# Altium project 499H_VOL_DEV_V1.PrjPcb (part 1 of 2)
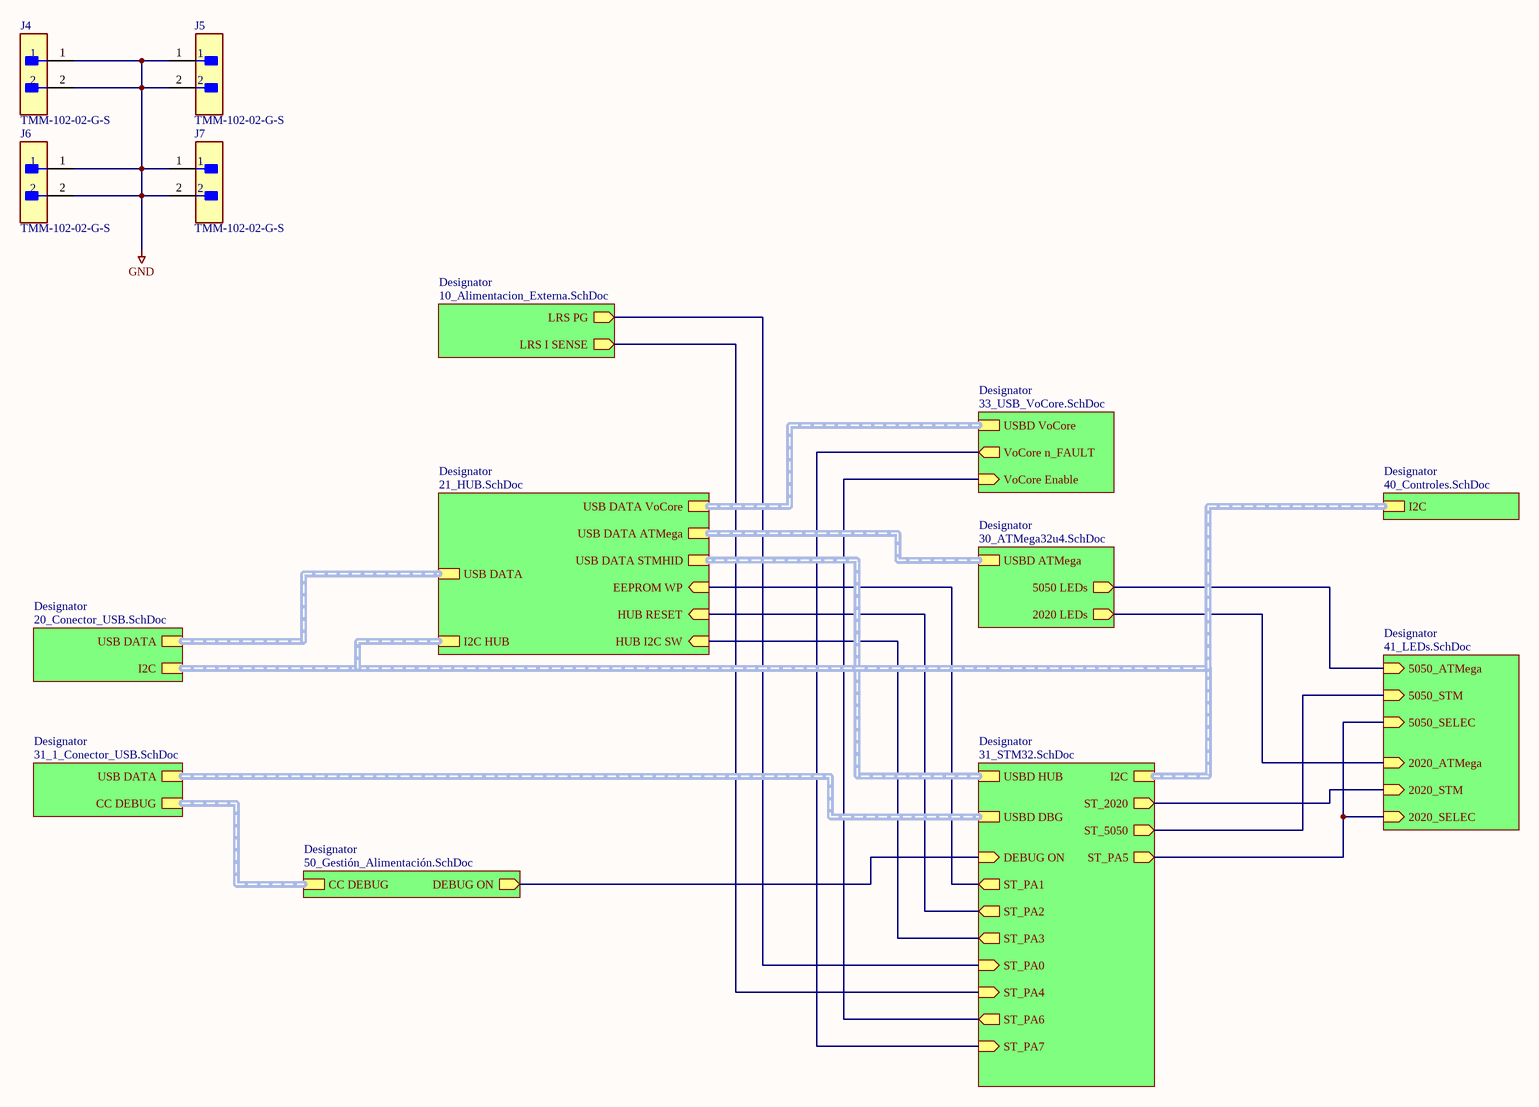
[diagram p0: 00_Principal.SchDoc]
11 sheets, 247 parts. Net scope: hierarchical (ports join the sheet entries above them; power ports are global).
Board file: Placa PCB.PcbDoc
Sheets:
  00_Principal.SchDoc
    Designator = 10_Alimentacion_Externa.SchDoc
    Designator = 20_Conector_USB.SchDoc
    Designator = 21_HUB.SchDoc
    Designator = 31_1_Conector_USB.SchDoc
    Designator = 50_Gestión_Alimentación.SchDoc
    Designator = 31_STM32.SchDoc
    Designator = 30_ATMega32u4.SchDoc
    Designator = 33_USB_VoCore.SchDoc
    Designator = 41_LEDs.SchDoc
    Designator = 40_Controles.SchDoc

## Sheet 00_Principal.SchDoc
size A3; SheetNumber: 1; SheetTotal: 11

### Parts
J4  TMM-102-02-G-S  [FP-TMM-102-02-G-S-MFG]
J5  TMM-102-02-G-S  [FP-TMM-102-02-G-S-MFG]
J6  TMM-102-02-G-S  [FP-TMM-102-02-G-S-MFG]
J7  TMM-102-02-G-S  [FP-TMM-102-02-G-S-MFG]

### Sub-sheets
Designator = 10_Alimentacion_Externa.SchDoc: LRS PG (out), LRS I SENSE (out)
Designator = 20_Conector_USB.SchDoc: USB DATA (harness USBD LINK), I2C (harness I2C BUS)
Designator = 21_HUB.SchDoc: HUB RESET (in), USB DATA (harness USBD BUS), USB DATA VoCore (harness USBD BUS), USB DATA ATMega (harness USBD BUS), USB DATA STMHID (harness USBD BUS), EEPROM WP (in), HUB I2C SW (in), I2C HUB (harness I2C BUS)
Designator = 31_1_Conector_USB.SchDoc: USB DATA (harness USBD LINK), CC DEBUG (harness CC BUS)
Designator = 50_Gestión_Alimentación.SchDoc: CC DEBUG (harness CC BUS), DEBUG ON (out)
Designator = 31_STM32.SchDoc: USBD HUB (harness USBD BUS), I2C (harness I2C BUS), ST_2020 (out), ST_5050 (out), ST_PA0 (in), ST_PA1 (out), ST_PA2 (out), ST_PA3 (out), ST_PA4 (in), ST_PA5 (out), DEBUG ON (in), USBD DBG (harness USBD BUS), ST_PA7 (in), ST_PA6 (out)
Designator = 30_ATMega32u4.SchDoc: 5050 LEDs (out), 2020 LEDs (out), USBD ATMega (harness USBD BUS)
Designator = 33_USB_VoCore.SchDoc: USBD VoCore (harness USBD BUS), VoCore n_FAULT (out), VoCore Enable (in)
Designator = 41_LEDs.SchDoc: 5050_ATMega (in), 5050_STM (in), 5050_SELEC (in), 2020_ATMega (in), 2020_STM (in), 2020_SELEC (in)
Designator = 40_Controles.SchDoc: I2C (harness I2C BUS)

### Nets
GND: J4.1 J4.2 J5.1 J5.2 J6.1 J6.2 J7.1 J7.2
AT_2020: sheet Designator/2020 LEDs, sheet Designator/2020_ATMega
AT_5050: sheet Designator/5050 LEDs, sheet Designator/5050_ATMega
DEBUG ON: sheet Designator/DEBUG ON, sheet Designator/DEBUG ON
HUB_RESET: sheet Designator/HUB RESET, sheet Designator/ST_PA2
IMON: sheet Designator/LRS I SENSE, sheet Designator/ST_PA4
LRS PG: sheet Designator/LRS PG, sheet Designator/ST_PA0
ST_2020: sheet Designator/ST_2020, sheet Designator/2020_STM
ST_5050: sheet Designator/ST_5050, sheet Designator/5050_STM
ST_PA1: sheet Designator/EEPROM WP, sheet Designator/ST_PA1
ST_PA3: sheet Designator/HUB I2C SW, sheet Designator/ST_PA3
ST_PA5: sheet Designator/ST_PA5, sheet Designator/5050_SELEC, sheet Designator/2020_SELEC
ST_PA6: sheet Designator/ST_PA6, sheet Designator/VoCore Enable
ST_PA7: sheet Designator/ST_PA7, sheet Designator/VoCore n_FAULT

### Buses and harness runs
harness sheet Designator/I2C = sheet Designator/I2C HUB
harness sheet Designator/USB DATA = sheet Designator/USBD DBG
harness sheet Designator/USB DATA ATMega = sheet Designator/USBD ATMega
harness sheet Designator/USB DATA STMHID = sheet Designator/USBD HUB
harness sheet Designator/USB DATA VoCore = sheet Designator/USBD VoCore

### Library data of the parts
J4-J7 = CMP-02766-001563-1: CONN HEADER VERT 2POS 2MM; Gender: Male; Number of Positions: 2; Max Current Rating: 3.9A; Max Voltage Rating (AC): 500V; Fastening Type: Pull; Series: TMM; Orientation: Straight; RoHS Compliant: Yes; Contact Shape: Square; Packaging: Bulk; Max Operating Temperature: 125°C; Pitch: 2mm; Termination: Solder; Insulation Color: Black; Contact Plating: Gold; Radiation Hardening: No; Contact Finish - Mating: GOLD; Insulation Material: Polymer; Number of Contacts: 2; Depth: 1.97mm; Contact Type: Male Pin; Number of Rows: 1; Connector Type: Header; Mount: Through Hole; Min Operating Temperature: -55°C; Housing Material: Polymer; Contact Material: Bronze; Housing Color: Black; Length: 4mm

## Sheet 10_Alimentacion_Externa.SchDoc
size A4; SheetNumber: 2; SheetTotal: 11
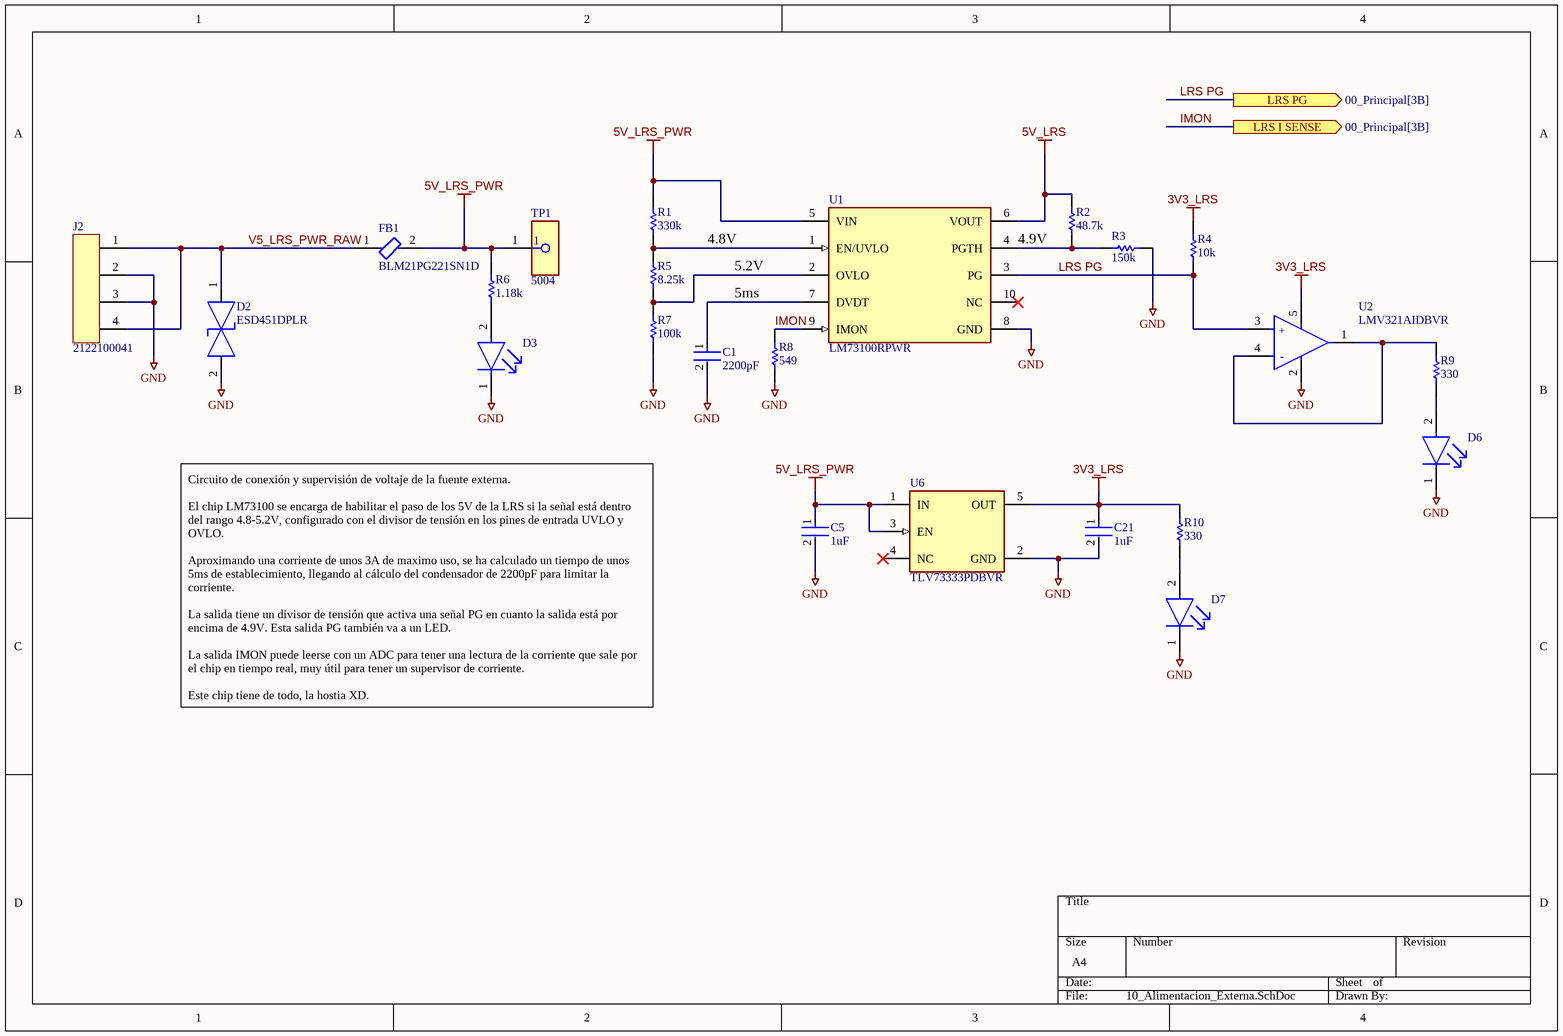
[diagram p1: 10_Alimentacion_Externa.SchDoc]

### Parts
C1  2200pF  [FP-AC0402-0_5-MFG]
C5  1uF  [FP-C0402C-BB-IPC_B]
C21  1uF  [FP-C0402C-BB-IPC_B]
D2  ESD451DPLR  [FP-DPL0002A_MFG]
D3  APHD1608LZGCK  [FP-APHD1608LZGCK-MFG]  (value not drawn)
D6  APHD1608LZGCK  [FP-APHD1608LZGCK-MFG]  (value not drawn)
D7  APHD1608LZGCK  [FP-APHD1608LZGCK-MFG]  (value not drawn)
FB1  BLM21PG221SN1D  [FP-BLM21-0_2-t0_85-e0_5-IPC_B]
J2  2122100041  [2122100041]
R1  330k  [RESC1005X40X25ML05T05]
R2  48.7k  [RESC1005X40X25ML05T05]
R3  150k  [RESC1005X40X25NL05T05]
R4  10k  [RESC1005X40X25ML05T05]
R5  8.25k  [RESC1005X40X25LL05T05]
R6  1.18k  [RESC1005X40X25NL05T05]
R7  100k  [RESC1005X40X25LL05T05]
R8  549  [RESC1005X40X25LL05T05]
R9  330  [RESC1005X40X25NL10T10]
R10  330  [RESC1005X40X25NL10T10]
TP1  5004  [FP-5004-MFG]
U1  LM73100RPWR  [FP-RPW0010A-MFG]
U2  LMV321AIDBVR  [FP-DBV0005A-MFG]
U6  TLV73333PDBVR  [FP-DBV0005A-MFG]

### Ports
LRS I SENSE (out, see 00_Principal[3B]), LRS PG (out, see 00_Principal[3B])

### Nets
3V3_LRS: C21.1 R4.2 R10.2 U2.5(V+) U6.5(OUT)
5V_LRS: R2.2 U1.6(VOUT)
5V_LRS_PWR: C5.1 FB1.2 R1.2 R6.2 TP1.1 U1.5(VIN) U6.1(IN) U6.3(EN)
GND: C1.2 C5.2 C21.2 D2.2(2_IO) D3.1(C) D6.1(C) D7.1(C) J2.2 J2.3 R3.2 R7.2 R8.1 U1.8(GND) U2.2(V-) U6.2(GND)
IMON: R8.2 U1.9(IMON) ; port LRS I SENSE
LRS PG: R4.1 U1.3(PG) U2.3(+IN) ; port LRS PG
V5_LRS_PWR_RAW: D2.1(1_IO) FB1.1 J2.1 J2.4
NetC1_1: C1.1 U1.7(DVDT)
NetD3_2: D3.2(A) R6.1
NetD6_2: D6.2(A) R9.1
NetD7_2: D7.2(A) R10.1
NetR1_1: R1.1 R5.2 U1.1(EN/UVLO)
NetR2_1: R2.1 R3.1 U1.4(PGTH)
NetR5_1: R5.1 R7.1 U1.2(OVLO)
NetR9_2: R9.2 U2.1(OUT) U2.4(-IN)

Not connected (* = marked no-connect by the designer): U1 10(NC)*; U6 4(NC)*

### Notes on the sheet
- 4.8V
- 4.9V
- 5.2V
- 5ms
- Circuito de conexión y supervisión de voltaje de la fuente externa.
  El chip LM73100 se encarga de habilitar el paso de los 5V de la LRS si la señal está dentro del rango 4.8-5.2V, configurado con el divisor de tensión en los pines de entrada UVLO y OVLO.
  Aproximando una corriente de unos 3A de maximo uso, se ha calculado un tiempo de unos 5ms de establecimiento, llegando al cálculo del condensador de 2200pF para limitar la corriente.
  La salida tiene un divisor de tensión que activa una señal PG en cuanto la salida está por encima de 4.9V. Esta salida PG también va a un LED.
  La salida IMON puede leerse con un ADC para tener una lectura de la corriente que sale por el chip en tiempo real, muy útil para tener un supervisor de corriente.
  Este chip tiene de todo, la hostia XD.
- (in symbol CMP-04895-000333-1) +; -

### Library data of the parts
C1 = CMP-03422-000165-1: CAP CER 2200PF 16V X7R 0402; Manufacturer Part Number: AC0402KRX7R7BB222; Manufacturer: Yageo; Capacitance: 2.2 nF; Temperature Coefficient: ±15%; Automotive Grade: Grade 1; Value: 2.2 nF; Material: Ceramic; Tolerance: 0.1; Digikey Description: CAP CER 2200PF 16V X7R 0402; Temperature: -55°C to +125°C; Device Class L1: Passive Components; Device Class L3: Ceramic Capacitors; Temperature Range High: +125°C; Temperature Characteristic: X7R; Lead Free: Yes; Device Class L2: Capacitors; Voltage Rating: 16 V; Package: AC0402-0.5; Temperature Range Low: -55°C; Footprint Url: http://www.yageo.com/exep/pages/download/literatures/UPY-C_GEN_24.pdf; ComponentLink2Description: Datasheet; Automotive: Yes; Mouser Description: Cap Ceramic 0.0022uF 16V X7R 10% SMD 0402 125°C Paper T/R; Octopart: https://octopart.com/ac0402krx7r7bb222-yageo-76900921; Height: 0.55mm; ComponentLink2URL: http://www.yageo.com/documents/recent/UPY-AC_NP0X7R_16V-to-630V_12.pdf; Category: Cap; RoHS: TRUE; Ipc Land Pattern Name: CAPC10050X50
C5 C21 = CMP-03020-034679-1: CAP CER 1UF 16V X5R 0402; Dielectric Material: Ceramic; Tolerance: 10%; RoHS Compliant: Yes; Voltage Rating (DC): 16V; Voltage Rating: 16V; Max Operating Temperature: 85°C; Packaging: Cut Tape; Width: 0.02inch; Dielectric: X5R; Lead Free: Lead Free; Min Operating Temperature: -55°C; Mount: Surface Mount; Case/Package: 0402; Thickness: 0.022inch; REACH SVHC: No SVHC; Length: 0.039inch; Case Code (Metric): 1005; Case Code (Imperial): 0402; Capacitance: 1uF
D2 = CMP-00370-140306676-1: 0.5-pF, 5.5-V, 30-KV bidirectional ESD protection device in 0201 package 2-X2SON -40 to 125; Manufacturer Lifecycle Status: ACTIVE; Thickness: 300µm; ComponentLink3URL: https://www.ti.com/lit/ds/symlink/tpd1e04u04.pdf?ts=1701165483995&ref_url=https%253A%252F%252Fwww.ti.com%252Fproduct%252FTPD1E04U04%252Fpart-details%252FTPD1E04U04DPLR; ComponentLink3Description: Manufacturer's Package Drawing; Lifecycle Status: Production; ComponentLink1URL: http://ti.com; ComponentLink2Description: HelpURL; Width: 300µm; ComponentLink2URL: https://www.ti.com/lit/ds/symlink/esd451.pdf; Height: 320µm; Number of Pins: 2; ComponentLink1Description: Manufacturer's Website; Length: 600µm
D3 D6 D7 = CMP-44529-000045-1: LED GREEN CLEAR 1608 SMD; Test Current: 2mA; Dominant Wavelength: 525nm; Lens Color: Colorless; Luminous Intensity: 180mcd; Viewing Angle: 100°; Forward Voltage: 2.65V; Lens Size: 0.7mm; Lens Style: Round; Mount: Surface Mount; Packaging: Tape and Reel; Lens Transparency: Clear; Height: 0.75mm; Case/Package: 0603; Length: 1.6mm; Case Code (Metric): 1608; Width: 0.8mm; Color: Green; Case Code (Imperial): 0603
FB1 = CMP-0686-00610-3: Chip Ferrite Bead, 0805, 220Ω @ 100MHz, 0.045Ω, 25%, 2A; Number of Circuits: 1; Shielding: Unshielded; DC Resistance (DCR): 45mR; Impedance: 220R; Radiation Hardening: No; Material: Ferrite; Frequency: 100MHz; Width: 1.25mm; DC Current: 2A; Max DC Current: 2A; Number of Lines: 1; Package Quantity: 1; Case Code (Metric): 2012; Current Rating: 2A; Case/Package: 0805; Current: 2A; Military Standard: Not; Core Material: Ferrite; Depth: 1.25mm; Contact Plating: Tin; DC Resistance-Max: 45mR; Max Operating Temperature: 125°C; Length: 2mm; Max Current Rating: 2A; REACH SVHC: No SVHC; Termination: SMD/SMT; Min Operating Temperature: -55°C; Series: BLM21P; Test Frequency: 100MHz; Tolerance: 25%; Number of Pins: 2; RoHS Compliant: Yes; Height: 0.85mm; Packaging: Tape and Reel; Lead Free: Lead Free; Case Code (Imperial): 0805
R1 = CMP-1011-00134-2: Part Number: ERJ-2GEJ334X; Manufacturer: Panasonic
R2 = CMP-2002-00962-1: Part Number: ERJ-2RKF4872X; Manufacturer: Panasonic
R3 = CMP-2002-00459-1: Part Number: ERJ-2GEJ154X; Manufacturer: Panasonic
R4 = CMP-2002-00601-1: Manufacturer: Panasonic; Part Number: ERJ-2RHD1002X
R5 = CMP-2002-01079-1: Part Number: ERJ-2RKF8251X; Manufacturer: Panasonic
R6 = CMP-1011-00517-2: Part Number: ERJ-2RKF1181X; Manufacturer: Panasonic
R7 = CMP-2002-00602-1: Manufacturer: Panasonic; Part Number: ERJ-2RHD1003X
R8 = CMP-2002-00989-1: Manufacturer: Panasonic; Part Number: ERJ-2RKF5490X
R9 R10 = CMP-2002-05883-1: Manufacturer: Panasonic; Part Number: ERA2AEB331X
TP1 = CMP-2000-05575-2: PC TEST POINT MINIATURE YELLOW; Manufacturer: Keystone; Number Of Contacts: 1; Is Female: yes; Device Class L1: Connectors; Manufacturer Part Number: 5004; Digikey Description: PC TEST POINT MINIATURE YELLOW; ComponentLink2URL: https://www.keyelco.com/product-pdf.cfm?p=1313; Lead Free: Yes; ComponentLink2Description: Datasheet; Category: Conn; Height: 4.72mm; Octopart: https://octopart.com/5004-keystone-28591; Mouser Description: TEST POINT PC MINI .040"D YELLOW; Device Class L3: unset; Contact Material: Silver; Package: 5004; Automotive: No; Device Class L2: unset; RoHS: TRUE
U1 = CMP-04910-000122-1: 2.7-V TO 23-V, 5.5-A IDEAL DIODE; RoHS Compliant: Yes
U2 = CMP-04895-000333-1: IC OPAMP GP 1 CIRCUIT SOT23-5; Input Bias Current: 10pA; Output Current per Channel: 40mA; Gain Bandwidth Product: 1MHz; Input Offset Voltage (Vos): 1mV; Number of Channels: 1; Operating Supply Current: 80uA; Slew Rate: 1.7V/µs; Mount: Surface Mount; Min Operating Temperature: -40°C; Packaging: Cut Tape; Case/Package: SOT-23-5; RoHS Compliant: Yes; Max Operating Temperature: 125°C; Number of Circuits: 1
U6 = CMP-04917-000053-1: IC REG LINEAR 3.3V 300MA SOT23-5; Manufacturer: Texas Instruments; Max Junction Temp: +125°C; Accuracy Percentage: 1%; Min Supply Voltage: 1.4V; Number Of Outputs: 1; Dropout Voltage: 125mV; Nominal Supply Current: 34uA; Max Supply Voltage: 5.5V; Output Type: Fixed; Standoff Height: 0mm; Digikey Description: IC REG LINEAR 3.3V 300MA SOT23-5; Manufacturer Part Number: TLV73333PDBVR; Temperature Range High: +125°C; Temperature: -40°C to +125°C; Output Current: 300mA; Mouser Description: LDO Voltage Regulators Capacitr-Free 300-mA 5-SOT-23 -40 to 125; Automotive: No; Height: 1.45mm; Device Class L3: Voltage Regulators - Linear; ComponentLink2Description: Datasheet; Device Class L1: Integrated Circuits (ICs); ComponentLink2URL: http://www.ti.com/lit/ds/symlink/tlv733p.pdf; Octopart: https://octopart.com/tlv73333pdbvr-texas+instruments-51080890; Temperature Range Low: -40°C; RoHS: TRUE; Lead Free: Yes; Output Voltage: 3.3V; Package: DBV0005A; Device Class L2: Power Management ICs; Category: IC

## Sheet 20_Conector_USB.SchDoc
size A4; SheetNumber: 3; SheetTotal: 11
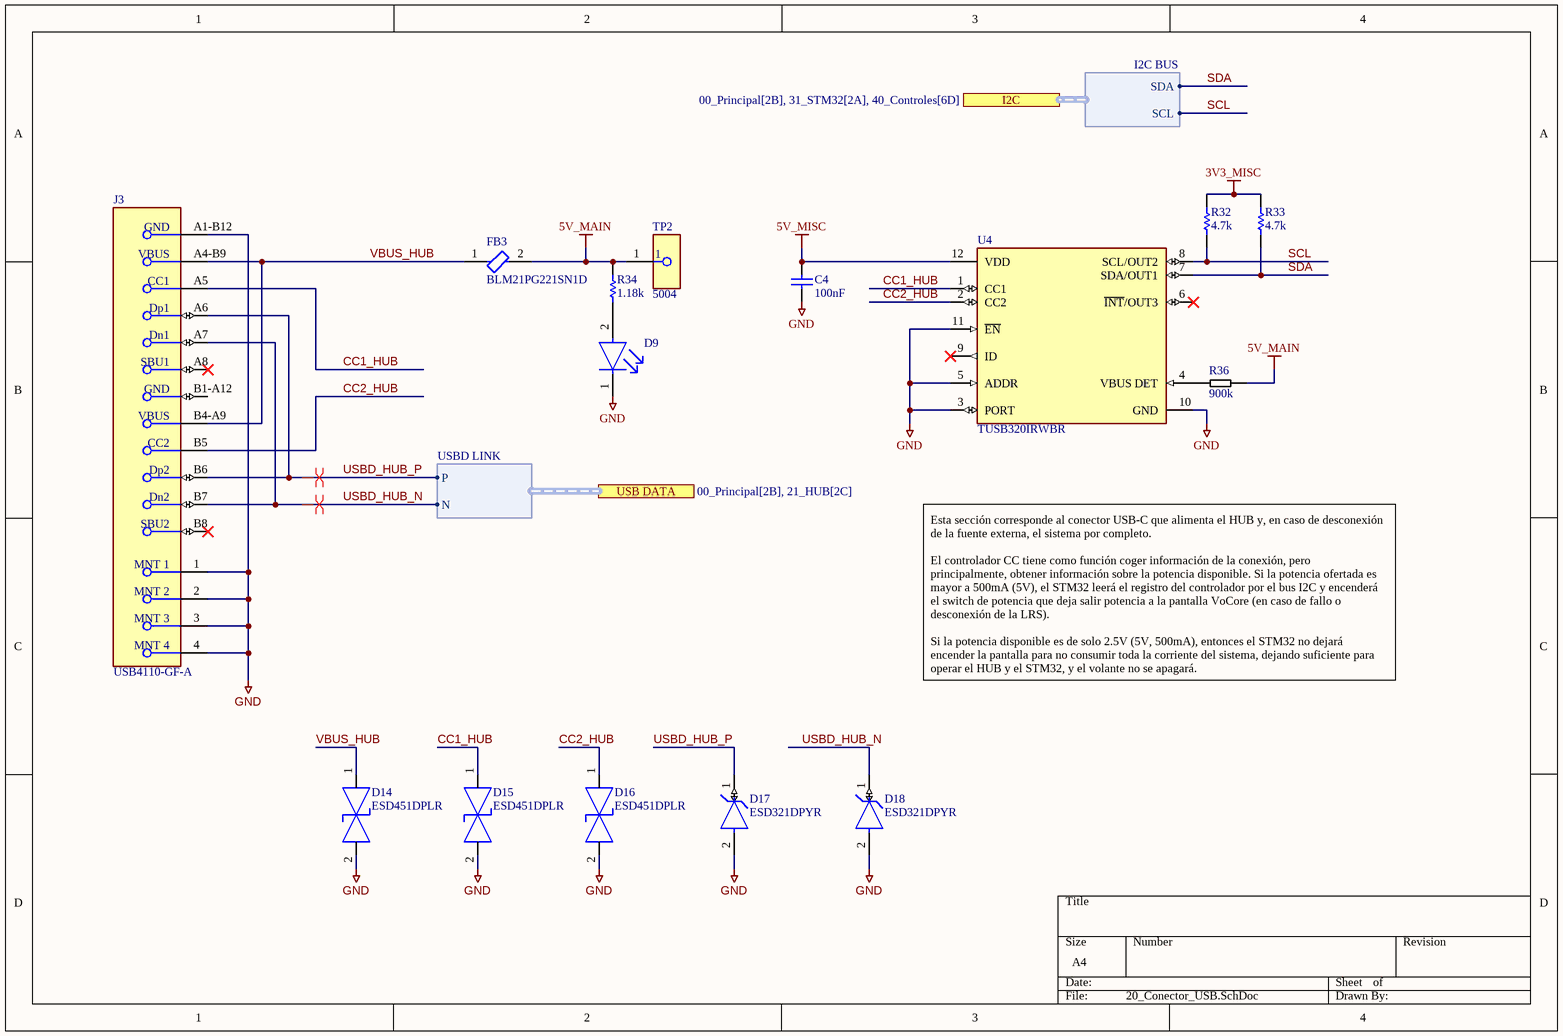
[diagram p2: 20_Conector_USB.SchDoc]

### Parts
C4  100nF  [CAPC1005X55X25NL05T05]
D9  APHD1608LZGCK  [FP-APHD1608LZGCK-MFG]  (value not drawn)
D14  ESD451DPLR  [FP-DPL0002A_MFG]
D15  ESD451DPLR  [FP-DPL0002A_MFG]
D16  ESD451DPLR  [FP-DPL0002A_MFG]
D17  ESD321DPYR  [FP-DPY0002A-MFG]
D18  ESD321DPYR  [FP-DPY0002A-MFG]
FB3  BLM21PG221SN1D  [FP-BLM21-0_2-t0_85-e0_5-IPC_B]
J3  USB4110-GF-A  [FP-USB4110-GF-A-MFG]
R32  4.7k  [RESC1005X40X25ML05T10]
R33  4.7k  [RESC1005X40X25ML05T10]
R34  1.18k  [RESC1005X40X25NL05T05]
R36  900k  [RES 1206]
TP2  5004  [FP-5004-MFG]
U4  TUSB320IRWBR  [FP-RWB0012A-MFG]

### Ports
I2C (harness I2C BUS, see 00_Principal[2B], 31_STM32[2A], 40_Controles[6D]), USB DATA (harness USBD LINK, see 00_Principal[2B], 21_HUB[2C])

### Harnesses
USBD LINK: P, N
I2C BUS: SDA, SCL

### Nets
3V3_MISC: R32.2 R33.2
5V_MAIN: FB3.2 R34.2 R36.1 TP2.1
5V_MISC: C4.2 U4.12(VDD)
GND: C4.1 D9.1(C) D14.2(2_IO) D15.2(2_IO) D16.2(2_IO) D17.2(GND) D18.2(GND) J3.1(MNT_1) J3.2(MNT_2) J3.3(MNT_3) J3.4(MNT_4) J3.A1-B12(GND) U4.3(PORT) U4.5(ADDR) U4.10(GND) U4.11(~{EN})
CC1_HUB: D15.1(1_IO) J3.A5(CC1) U4.1(CC1)
CC2_HUB: D16.1(1_IO) J3.B5(CC2) U4.2(CC2)
SCL: R32.1 U4.8(SCL/OUT2) ; port I2C.SCL
SDA: R33.1 U4.7(SDA/OUT1) ; port I2C.SDA
USBD_HUB_N: D18.1(IO) J3.A7(Dn1) J3.B7(Dn2) ; port USB DATA.N
USBD_HUB_P: D17.1(IO) J3.A6(Dp1) J3.B6(Dp2) ; port USB DATA.P
VBUS_HUB: D14.1(1_IO) FB3.1 J3.A4-B9(VBUS) J3.B4-A9(VBUS)
NetD9_2: D9.2(A) R34.1
NetR36_2: R36.2 U4.4(VBUS_DET)

Not connected (* = marked no-connect by the designer): J3 A8(SBU1)* B1-A12(GND) B8(SBU2)*; U4 6(~{INT}/OUT3)* 9(ID)*

### Layout directives
differential pair; rule Differential Pairs Routing [Pref Gap = 5mil    Min Gap  = 5mil    Max Gap  = 5milPref Width = 8.655mil    Min Width  = 8.655mil    Max Width  = 8.655mil]: USBD_HUB_N, USBD_HUB_P

### Notes on the sheet
- Esta sección corresponde al conector USB-C que alimenta el HUB y, en caso de desconexión de la fuente externa, el sistema por completo.
  El controlador CC tiene como función coger información de la conexión, pero principalmente, obtener información sobre la potencia disponible. Si la potencia ofertada es mayor a 500mA (5V), el STM32 leerá el registro del controlador por el bus I2C y encenderá el switch de potencia que deja salir potencia a la pantalla VoCore (en caso de fallo o desconexión de la LRS).
  Si la potencia disponible es de solo 2.5V (5V, 500mA), entonces el STM32 no dejará encender la pantalla para no consumir toda la corriente del sistema, dejando suficiente para operar el HUB y el STM32, y el volante no se apagará.

### Library data of the parts
C4 = CMP-2008-02030-1: Manufacturer: Vitramon; Part Number: VJ0402Y104KXJCW1BC
D9 = CMP-44529-000045-1: as D3 on sheet 10_Alimentacion_Externa; Mount: Surface Mount; Packaging: Tape and Reel; Lens Transparency: Clear; Height: 0.75mm; Case/Package: 0603; Length: 1.6mm; Case Code (Metric): 1608; Width: 0.8mm; Color: Green; Case Code (Imperial): 0603
D14-D16 = CMP-00370-140306676-1: as D2 on sheet 10_Alimentacion_Externa; Thickness: 300µm; ComponentLink3URL: https://www.ti.com/lit/ds/symlink/tpd1e04u04.pdf?ts=1701165483995&ref_url=https%253A%252F%252Fwww.ti.com%252Fproduct%252FTPD1E04U04%252Fpart-details%252FTPD1E04U04DPLR; ComponentLink3Description: Manufacturer's Package Drawing; Lifecycle Status: Production; ComponentLink1URL: http://ti.com; ComponentLink2Description: HelpURL; Width: 300µm; ComponentLink2URL: https://www.ti.com/lit/ds/symlink/esd451.pdf; Height: 320µm; Number of Pins: 2; ComponentLink1Description: Manufacturer's Website; Length: 600µm
D17 D18 = CMP-04989-000001-1: HDMI2.0 ESD PROTECTION; Manufacturer: Texas Instruments; Standoff Height: 0mm; Peak Pulse Current: 6A; Value: 0.9pF; Number Of Channels: 1; Reverse Standoff Voltage: 3.6V; Peak Pulse Power: 40W; Breakdown Voltage: 4.5V; Direction: Unidirectional; Clamping Voltage: 6.8V; RoHS: TRUE; Temperature: -40°C to +125°C; Package: DPY0002A; Temperature Range Low: -40°C; Temperature Range High: +125°C; Category: Diode; Capacitance: 0.9pF; Ambient Temperature Range Low: -40°C; Device Class L3: unset; Device Class L1: Circuit Protection; Ambient Temperature Range High: +125°C; ComponentLink2URL: http://www.ti.com/lit/ds/symlink/esd321.pdf; Octopart: https://octopart.com/esd321dpyr-texas+instruments-94354200; Manufacturer Part Number: ESD321DPYR; Digikey Description: HDMI2.0 ESD PROTECTION; Lead Free: Yes; ComponentLink2Description: Datasheet; Device Class L2: TVS Diodes; Height: 0.45mm; Automotive: No
FB3 = CMP-0686-00610-3: as FB1 on sheet 10_Alimentacion_Externa; Radiation Hardening: No; Material: Ferrite; Frequency: 100MHz; Width: 1.25mm; DC Current: 2A; Max DC Current: 2A; Number of Lines: 1; Package Quantity: 1; Case Code (Metric): 2012; Current Rating: 2A; Case/Package: 0805; Current: 2A; Military Standard: Not; Core Material: Ferrite; Depth: 1.25mm; Contact Plating: Tin; DC Resistance-Max: 45mR; Max Operating Temperature: 125°C; Length: 2mm; Max Current Rating: 2A; REACH SVHC: No SVHC; Termination: SMD/SMT; Min Operating Temperature: -55°C; Series: BLM21P; Test Frequency: 100MHz; Tolerance: 25%; Number of Pins: 2; RoHS Compliant: Yes; Height: 0.85mm; Packaging: Tape and Reel; Lead Free: Lead Free; Case Code (Imperial): 0805
J3 = CMP-245163-000002-1: CONN USB 2.0 TYPE-C R/A SMT; Manufacturer: GCT; Conn Orientation: Right Angle; Usb Standard: USB 2.0; Voltage Rating: 20V; Current Rating: 3/4.25/1.25/0.25A; Number Of Contacts: 16; Is Female: yes; Shielding: true; Standoff Height: 0.1mm; Octopart: https://octopart.com/usb4110-gf-a-gct-103941985; Temperature: -40°C to +85°C; RoHS: TRUE; Automotive: No; Contact Material: Gold,Nickel; Device Class L1: Connectors; Device Class L2: USB Connectors; Package: 0; Lead Free: Yes; ComponentLink2URL: https://gct.co/files/drawings/usb4110.pdf; Temperature Range High: +85°C; Temperature Range Low: -40°C; Height: 3.46mm; Manufacturer Part Number: USB4110-GF-A; ComponentLink2Description: Datasheet; Device Class L3: unset; Digikey Description: CONN USB 2.0 TYPE-C R/A SMT; Category: Conn
R32 R33 = CMP-2002-06456-1: Manufacturer: Panasonic; Part Number: ERJ-S02F4701X
R34 = CMP-1011-00517-2: as R6 on sheet 10_Alimentacion_Externa
R36 = RT1206CRE07900KL: 900k Resistor 200V 1206 0.5%; Supplier 1: DigiKey; Supplier Part Number 1: 13-RT1206CRE07900KLCT-ND
TP2 = CMP-2000-05575-2: as TP1 on sheet 10_Alimentacion_Externa; Device Class L1: Connectors; Manufacturer Part Number: 5004; Digikey Description: PC TEST POINT MINIATURE YELLOW; ComponentLink2URL: https://www.keyelco.com/product-pdf.cfm?p=1313; Lead Free: Yes; ComponentLink2Description: Datasheet; Category: Conn; Height: 4.72mm; Octopart: https://octopart.com/5004-keystone-28591; Mouser Description: TEST POINT PC MINI .040"D YELLOW; Device Class L3: unset; Contact Material: Silver; Package: 5004; Automotive: No; Device Class L2: unset; RoHS: TRUE
U4 = CMP-04877-000006-1: IC INTERFACE SPECIALIZED 12X2QFN; Number of Ports: 1; Max Supply Voltage: 5V; USB Standard: USB 1.1; Interface: I2C; Min Supply Voltage: 2.7V; ESD Protection: Yes; Data Rate: 480Mbps; REACH SVHC: No SVHC; Mount: Surface Mount; Min Operating Temperature: -40°C; Case/Package: TQFP; Lead Free: Lead Free; Length: 1.65mm; Contact Plating: Gold; Height: 0.4mm; Max Operating Temperature: 85°C; Number of Pins: 12; Packaging: Tape and Reel; RoHS Compliant: Yes; Width: 1.65mm

## Sheet 21_HUB.SchDoc
size A3; SheetNumber: 5; SheetTotal: 11
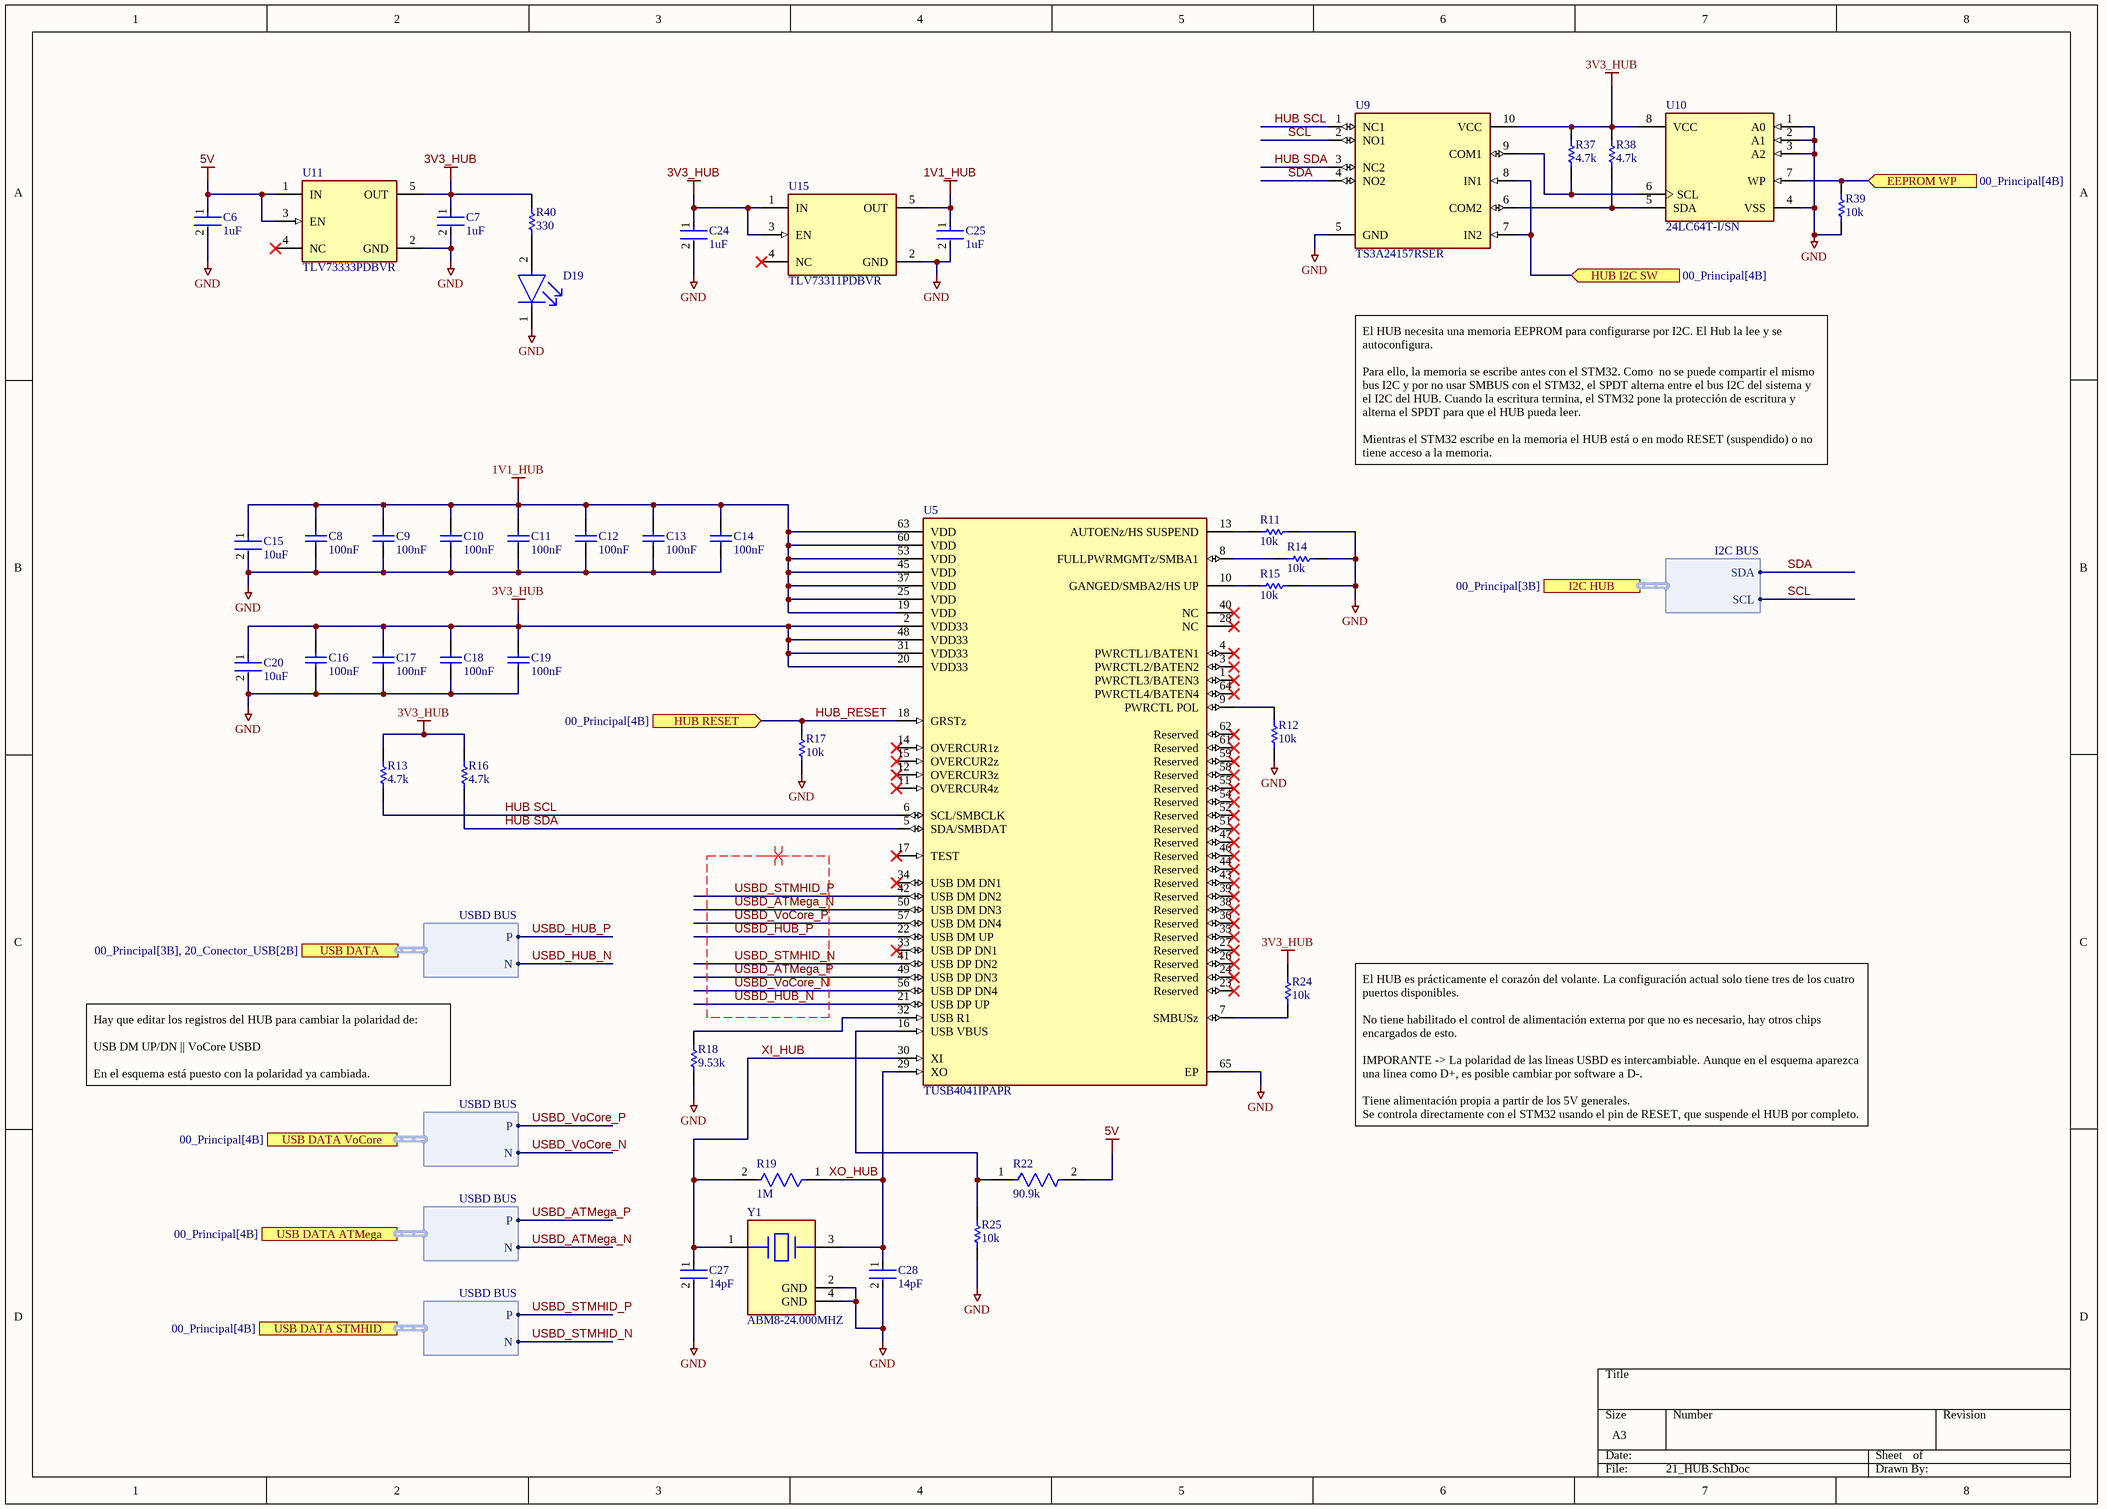
[diagram p3: 21_HUB.SchDoc]

### Parts
C6  1uF  [FP-C0402C-BB-IPC_B]
C7  1uF  [FP-C0402C-BB-IPC_B]
C8  100nF  [CAPC1005X55X25NL05T05]
C9  100nF  [CAPC1005X55X25NL05T05]
C10  100nF  [CAPC1005X55X25NL05T05]
C11  100nF  [CAPC1005X55X25NL05T05]
C12  100nF  [CAPC1005X55X25NL05T05]
C13  100nF  [CAPC1005X55X25NL05T05]
C14  100nF  [CAPC1005X55X25NL05T05]
C15  10uF  [FP-GRM155-0_2-MFG]
C16  100nF  [CAPC1005X55X25NL05T05]
C17  100nF  [CAPC1005X55X25NL05T05]
C18  100nF  [CAPC1005X55X25NL05T05]
C19  100nF  [CAPC1005X55X25NL05T05]
C20  10uF  [FP-GRM155-0_2-MFG]
C24  1uF  [FP-C0402C-BB-IPC_B]
C25  1uF  [FP-C0402C-BB-IPC_B]
C27  14pF  [FP-GJM155-0_05-IPC_C]
C28  14pF  [FP-GJM155-0_05-IPC_C]
D19  APHD1608LZGCK  [FP-APHD1608LZGCK-MFG]  (value not drawn)
R11  10k  [RESC1005X40X25ML05T05]
R12  10k  [RESC1005X40X25NL05T05]
R13  4.7k  [RESC1005X40X25ML05T10]
R14  10k  [RESC1005X40X25ML05T05]
R15  10k  [RESC1005X40X25ML05T05]
R16  4.7k  [RESC1005X40X25ML05T10]
R17  10k  [RESC1005X40X25ML05T05]
R18  9.53k  [RESC1609X50X30NL10T20]
R19  1M  [FP-CRCW0402-C-e3-IPC_B]
R22  90.9k  [FP-RK73H1E-IPC_C]
R24  10k  [RESC1005X40X25NL05T05]
R25  10k  [RESC1005X40X25NL05T05]
R37  4.7k  [RESC1005X40X25ML05T10]
R38  4.7k  [RESC1005X40X25ML05T10]
R39  10k  [RESC1005X40X25ML05T05]
R40  330  [RESC1005X40X25NL10T10]
U5  TUSB4041IPAPR  [FP-PAP0064K-MFG]
U9  TS3A24157RSER  [FP-RSE0010A-MFG]
U10  24LC64T-I/SN  [FP-C04-057-SN-MFG]
U11  TLV73333PDBVR  [FP-DBV0005A-MFG]
U15  TLV73311PDBVR  [FP-DBV0005A-IPC_C]
Y1  ABM8-24.000MHZ  [FP-ABM8-MFG]

### Ports
EEPROM WP (in, see 00_Principal[4B]), HUB I2C SW (in, see 00_Principal[4B]), HUB RESET (in, see 00_Principal[4B]), I2C HUB (harness I2C BUS, see 00_Principal[3B]), USB DATA (harness USBD BUS, see 00_Principal[3B], 20_Conector_USB[2B]), USB DATA ATMega (harness USBD BUS, see 00_Principal[4B]), USB DATA STMHID (harness USBD BUS, see 00_Principal[4B]), USB DATA VoCore (harness USBD BUS, see 00_Principal[4B])

### Harnesses
USBD BUS: P, N
I2C BUS: SDA, SCL

### Nets
1V1_HUB: C8.2 C9.2 C10.2 C11.2 C12.2 C13.2 C14.2 C15.1 C25.1 U5.19(VDD) U5.25(VDD) U5.37(VDD) U5.45(VDD) U5.53(VDD) U5.60(VDD) U5.63(VDD) U15.5(OUT)
3V3_HUB: C7.1 C16.2 C17.2 C18.2 C19.2 C20.1 C24.1 R13.2 R16.2 R24.2 R37.2 R38.2 R40.2 U5.2(VDD33) U5.20(VDD33) U5.31(VDD33) U5.48(VDD33) U9.10(VCC) U10.8(VCC) U11.5(OUT) U15.1(IN) U15.3(EN)
5V: C6.1 R22.2 U11.1(IN) U11.3(EN)
GND: C6.2 C7.2 C8.1 C9.1 C10.1 C11.1 C12.1 C13.1 C14.1 C15.2 C16.1 C17.1 C18.1 C19.1 C20.2 C24.2 C25.2 C27.2 C28.2 D19.1(C) R11.1 R12.1 R14.1 R15.1 R17.2 R18.1 R25.1 R39.2 U5.65(EP) U9.5(GND) U10.1(A0) U10.2(A1) U10.3(A2) U10.4(VSS) U11.2(GND) U15.2(GND) Y1.2(GND) Y1.4(GND)
HUB SCL: R13.1 U5.6(SCL/SMBCLK) U9.1(NC1)
HUB SDA: R16.1 U5.5(SDA/SMBDAT) U9.3(NC2)
HUB_RESET: R17.1 U5.18(GRSTz) ; port HUB RESET
SCL: U9.2(NO1) ; port I2C HUB.SCL
SDA: U9.4(NO2) ; port I2C HUB.SDA
ST_PA1: R39.1 U10.7(WP) ; port EEPROM WP
ST_PA3: U9.7(IN2) U9.8(IN1) ; port HUB I2C SW
USBD_ATMega_N: U5.50(USB_DM_DN3) ; port USB DATA ATMega.N
USBD_ATMega_P: U5.49(USB_DP_DN3) ; port USB DATA ATMega.P
USBD_HUB_N: U5.21(USB_DP_UP) ; port USB DATA.N
USBD_HUB_P: U5.22(USB_DM_UP) ; port USB DATA.P
USBD_STMHID_N: U5.41(USB_DP_DN2) ; port USB DATA STMHID.N
USBD_STMHID_P: U5.42(USB_DM_DN2) ; port USB DATA STMHID.P  [project net STMHUB_D_P]
USBD_VoCore_N: U5.56(USB_DP_DN4) ; port USB DATA VoCore.N
USBD_VoCore_P: U5.57(USB_DM_DN4) ; port USB DATA VoCore.P
XI_HUB: C27.1 R19.2 U5.30(XI) Y1.1
XO_HUB: C28.1 R19.1 U5.29(XO) Y1.3
NetD19_2: D19.2(A) R40.1
NetR11_2: R11.2 U5.13(AUTOENz/HS_SUSPEND)
NetR12_2: R12.2 U5.9(PWRCTL_POL)
NetR14_2: R14.2 U5.8(FULLPWRMGMTz/SMBA1)
NetR15_2: R15.2 U5.10(GANGED/SMBA2/HS_UP)
NetR18_2: R18.2 U5.32(USB_R1)
NetR22_1: R22.1 R25.2 U5.16(USB_VBUS)
NetR24_1: R24.1 U5.7(SMBUSz)
NetR37_1: R37.1 U9.9(COM1) U10.6(SCL)
NetR38_1: R38.1 U9.6(COM2) U10.5(SDA)

Not connected (* = marked no-connect by the designer): U5 1(PWRCTL3/BATEN3)* 3(PWRCTL2/BATEN2)* 4(PWRCTL1/BATEN1)* 11(OVERCUR4z)* 12(OVERCUR3z)* 14(OVERCUR1z)* 15(OVERCUR2z)* 17(TEST)* 23(Reserved)* 24(Reserved)* 26(Reserved)* 27(Reserved)* 28(NC)* 33(USB_DP_DN1)* 34(USB_DM_DN1)* 35(Reserved)* 36(Reserved)* 38(Reserved)* 39(Reserved)* 40(NC)* 43(Reserved)* 44(Reserved)* 46(Reserved)* 47(Reserved)* 51(Reserved)* 52(Reserved)* 54(Reserved)* 55(Reserved)* 58(Reserved)* 59(Reserved)* 61(Reserved)* 62(Reserved)* 64(PWRCTL4/BATEN4)*; U11 4(NC)*; U15 4(NC)*

### Layout directives
differential pair; rule Differential Pairs Routing [Pref Gap = 5mil    Min Gap  = 5mil    Max Gap  = 5milPref Width = 8.655mil    Min Width  = 8.655mil    Max Width  = 8.655mil]: USBD_ATMega_N, USBD_ATMega_P, USBD_HUB_N, USBD_HUB_P, USBD_STMHID_N, USBD_STMHID_P, USBD_VoCore_N, USBD_VoCore_P

### Notes on the sheet
- El HUB necesita una memoria EEPROM para configurarse por I2C. El Hub la lee y se autoconfigura.
  Para ello, la memoria se escribe antes con el STM32. Como  no se puede compartir el mismo bus I2C y por no usar SMBUS con el STM32, el SPDT alterna entre el bus I2C del sistema y el I2C del HUB. Cuando la escritura termina, el STM32 pone la protección de escritura y alterna el SPDT para que el HUB pueda leer.
  Mientras el STM32 escribe en la memoria el HUB está o en modo RESET (suspendido) o no tiene acceso a la memoria.
- Hay que editar los registros del HUB para cambiar la polaridad de:
  USB DM UP/DN || VoCore USBD
  En el esquema está puesto con la polaridad ya cambiada.
- El HUB es prácticamente el corazón del volante. La configuración actual solo tiene tres de los cuatro puertos disponibles.
  No tiene habilitado el control de alimentación externa por que no es necesario, hay otros chips encargados de esto.
  IMPORANTE -> La polaridad de las lineas USBD es intercambiable. Aunque en el esquema aparezca una linea como D+, es posible cambiar por software a D-.
  Tiene alimentación propia a partir de los 5V generales.
  Se controla directamente con el STM32 usando el pin de RESET, que suspende el HUB por completo.

### Library data of the parts
C6 C7 C24 C25 = CMP-03020-034679-1: as C5 on sheet 10_Alimentacion_Externa; RoHS Compliant: Yes; Voltage Rating (DC): 16V; Voltage Rating: 16V; Max Operating Temperature: 85°C; Packaging: Cut Tape; Width: 0.02inch; Dielectric: X5R; Lead Free: Lead Free; Min Operating Temperature: -55°C; Mount: Surface Mount; Case/Package: 0402; Thickness: 0.022inch; REACH SVHC: No SVHC; Length: 0.039inch; Case Code (Metric): 1005; Case Code (Imperial): 0402; Capacitance: 1uF
C8-C14 C16-C19 = CMP-2008-02030-1: as C4 on sheet 20_Conector_USB
C15 C20 = CMP-06035-002770-1: Chip Multilayer Ceramic Capacitors for General Purpose, 0402, 10uF, X5R, 15%, 20%, 4V
C27 C28 = CMP-06035-029519-1: Multi-Layer Ceramic Capacitor 14pF C0G  ±1% 0402 Paper T/R
D19 = CMP-44529-000045-1: as D3 on sheet 10_Alimentacion_Externa; Mount: Surface Mount; Packaging: Tape and Reel; Lens Transparency: Clear; Height: 0.75mm; Case/Package: 0603; Length: 1.6mm; Case Code (Metric): 1608; Width: 0.8mm; Color: Green; Case Code (Imperial): 0603
R11 R12 R14 R15 R17 R24 R25 R39 = CMP-2002-00601-1: as R4 on sheet 10_Alimentacion_Externa
R13 R16 R37 R38 = CMP-2002-06456-1: as R32 on sheet 20_Conector_USB
R18 = CMP-2000-03655-1: Manufacturer: Vishay Dale; Part Number: CRCW06039K53FKEA
R19 = CMP-02407-013080-1: RES 1M OHM 1% 1/16W 0402; Max Power Dissipation: 63mW; Temperature Coefficient: 100ppm/°C; Power Rating: 62.5mW; Resistance: 1MR; Tolerance: 1%; Contact Plating: Tin; Max Operating Temperature: 155°C; Number of Terminations: 2; Min Operating Temperature: -55°C; Lead Free: Lead Free; Length: 1mm; RoHS Compliant: Yes; Series: CRCW-C; Case/Package: 0402; Packaging: Tape and Reel; Mount: Surface Mount; Resistor Type: Thick Film; Termination: Wraparound
R22 = CMP-04015-083698-1: 90.9kΩ ±1% 0.1W Chip Resistor 0402 Flat Chip (Anti-Sulfuration) AEC-Q200 Qualified; Voltage Rating: 50V; Resistance: 90.9kR; Power Rating: 63mW; Temperature Coefficient: 100ppm/°C; Case Code (Metric): 1005; Tolerance: 1%; Case/Package: 0402; Width: 0.5mm; Case Code (Imperial): 0402; Height: 0.35mm; Weight: 2.3E-05oz; Min Operating Temperature: -55°C; Length: 1mm; RoHS Compliant: Yes; Termination: SMD/SMT; Max Operating Temperature: 155°C; Packaging: Tape and Reel; Package Quantity: 10000
R40 = CMP-2002-05883-1: as R9 on sheet 10_Alimentacion_Externa
U5 = CMP-04877-000003-1: IC USB 2.0 4PORT HUB 64HTQFP; Manufacturer: Texas Instruments; Interface: I2C,USB,SMBus; Max Supply Voltage: 3.6V; Nominal Supply Current: 15uA; Standoff Height: 0.05mm; Min Supply Voltage: 0.99V; Usb Standard: USB 2.0; Number Of Ports: 4; Max Junction Temp: +105°C; Data Rate: 480Mbits/s; Temperature: -40°C to +85°C; ComponentLink2Description: Datasheet; Category: IC; Device Class L3: USB Interface ICs; Device Class L2: Interface ICs; Height: 1.2mm; ComponentLink2URL: http://www.ti.com/lit/ds/symlink/tusb4041i.pdf; Ipc Land Pattern Name: QFP50P1200X1200X120-64; Temperature Range High: +85°C; Lead Free: Yes; Manufacturer Part Number: TUSB4041IPAPR; Temperature Range Low: -40°C; RoHS: TRUE; Digikey Description: IC USB 2.0 4PORT HUB 64HTQFP; Device Class L1: Integrated Circuits (ICs); Ambient Temperature Range Low: -40°C; Automotive: No; Package: PAP0064K; Octopart: https://octopart.com/tusb4041ipapr-texas+instruments-61734371; Ambient Temperature Range High: +85°C
U9 = CMP-04892-000112-1: IC SWITCH DUAL SPDT 10UQFN; Polarity: Non-Inverting; Max Supply Current: 25nA; Operating Supply Voltage: 3V; Number of Outputs: 4; Number of Inputs: 2; Supply Type: Single; Bandwidth: 50MHz; Turn-On Delay Time: 35ns; Low Level Output Current: 300mA; Operating Supply Current: 15nA; On-State Resistance: 600mR; Min Supply Voltage: 1.65V; Turn-Off Delay Time: 25ns; Max Supply Voltage: 3.6V; RoHS Compliant: Yes; Max Operating Temperature: 85°C; Series: -; Radiation Hardening: No; Width: 1.55mm; Number of Pins: 10; REACH SVHC: No SVHC; Contact Plating: Gold; Length: 2.05mm; Number of Channels: 2; Min Operating Temperature: -40°C; Lead Free: Lead Free; Mount: Surface Mount; Packaging: Tape and Reel; Weight: 0.000247oz; Package Quantity: 1; Case/Package: QFN; High Level Output Current: 300mA; Height: 0.55mm; Throw Configuration: SPDT
U10 = CMP-0159-00199-2: IC EEPROM 64K I2C 400KHZ 8SOIC; Manufacturer: Microchip Technology; Min Supply Voltage: 2.5V; Interface: I2C,2-Wire; Access Time: 900ns; Memory Size: 64Kbits; Max Supply Voltage: 5.5V; Nominal Supply Current: 0.05-100uA; Standoff Height: 0.1mm; Temperature: -40°C to +85°C; Automotive: No; Ambient Temperature Range Low: -40°C; Device Class L1: Integrated Circuits (ICs); Footprint 1 Description: SOIC, 8-Leads, Body 4.9x3.8mm, Pitch 1.27mm, IPC High Density; Octopart: https://octopart.com/24lc64t-i%2Fsn-microchip-451854; Footprint Url: http://ww1.microchip.com/downloads/en/DeviceDoc/08L_SOIC_150_3dot9mm_SN_C04-00057e.pdf; Footprint 0 Description: SOIC, 8-Leads, Body 4.9x3.8mm, Pitch 1.27mm, IPC Medium Density; Memory Type: EEPROM; ComponentLink2Description: Datasheet; Digikey Description: IC EEPROM 64K I2C 400KHZ 8SOIC; Manufacturer Part Number: 24LC64T-I/SN; Temperature Range Low: -40°C; Footprint 2 Description: SOIC, 8-Leads, Body 4.9x3.8mm, Pitch 1.27mm, IPC Low Density; ComponentLink2URL: http://ww1.microchip.com/downloads/en/DeviceDoc/21189T.pdf; RoHS: TRUE; Device Class L2: Memory; Ambient Temperature Range High: +85°C; Mouser Description: EEPROM 8kx8 - 2.5V; Lead Free: Yes; Temperature Range High: +85°C; Frequency: 400kHz; Height: 1.75mm; Package: C04-057-SN; Ipc Land Pattern Name: SOIC127P600X175-8; Category: IC; Device Class L3: EEPROM
U11 = CMP-04917-000053-1: as U6 on sheet 10_Alimentacion_Externa; Digikey Description: IC REG LINEAR 3.3V 300MA SOT23-5; Manufacturer Part Number: TLV73333PDBVR; Temperature Range High: +125°C; Temperature: -40°C to +125°C; Output Current: 300mA; Mouser Description: LDO Voltage Regulators Capacitr-Free 300-mA 5-SOT-23 -40 to 125; Automotive: No; Height: 1.45mm; Device Class L3: Voltage Regulators - Linear; ComponentLink2Description: Datasheet; Device Class L1: Integrated Circuits (ICs); ComponentLink2URL: http://www.ti.com/lit/ds/symlink/tlv733p.pdf; Octopart: https://octopart.com/tlv73333pdbvr-texas+instruments-51080890; Temperature Range Low: -40°C; RoHS: TRUE; Lead Free: Yes; Output Voltage: 3.3V; Package: DBV0005A; Device Class L2: Power Management ICs; Category: IC
U15 = CMP-04917-000331-1: IC REG LINEAR 1.1V 300MA SOT23-5; Number of Regulators: 1; Quiescent Current: 34uA; Max Input Voltage: 5.5V; Min Input Voltage: 1.4V; Polarity: Positive; Power Supply Rejection Ratio (PSRR): 28dB; Output Type: Fixed; Accuracy: 1%; Dropout Voltage: 122mV; Min Current Limit: 360mA; Mount: Surface Mount; Number of Pins: 5; Case/Package: SOT-23-5; Max Output Current: 300mA; Min Operating Temperature: -40°C; Lead Free: Lead Free; Output Current: 300mA; Output Voltage: 1.1V; RoHS Compliant: Yes; Package Quantity: 3000; Number of Outputs: 1; Packaging: Tape and Reel; Contact Plating: Gold; Weight: 0.000557oz; Max Operating Temperature: 125°C
Y1 = CMP-27762-000457-1: Crystal 24MHz ±10ppm 12pF SMD-4 3.2mm x 2.5mm

## Sheet 31_1_Conector_USB.SchDoc
size A4; SheetNumber: 11; SheetTotal: 11
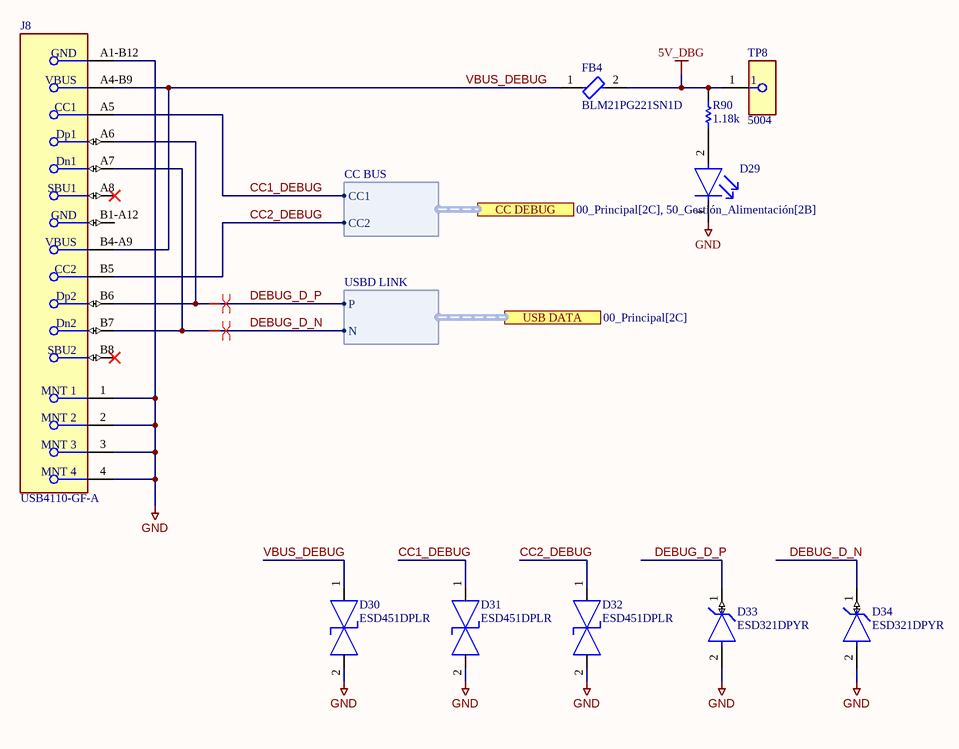
[diagram p4: 31_1_Conector_USB.SchDoc]

### Parts
D29  APHD1608LZGCK  [FP-APHD1608LZGCK-MFG]  (value not drawn)
D30  ESD451DPLR  [FP-DPL0002A_MFG]
D31  ESD451DPLR  [FP-DPL0002A_MFG]
D32  ESD451DPLR  [FP-DPL0002A_MFG]
D33  ESD321DPYR  [FP-DPY0002A-MFG]
D34  ESD321DPYR  [FP-DPY0002A-MFG]
FB4  BLM21PG221SN1D  [FP-BLM21-0_2-t0_85-e0_5-IPC_B]
J8  USB4110-GF-A  [FP-USB4110-GF-A-MFG]
R90  1.18k  [RESC1005X40X25NL05T05]
TP8  5004  [FP-5004-MFG]

### Ports
CC DEBUG (harness CC BUS, see 00_Principal[2C], 50_Gestión_Alimentación[2B]), USB DATA (harness USBD LINK, see 00_Principal[2C])

### Harnesses
USBD LINK: P, N
CC BUS: CC1, CC2

### Nets
5V_DBG: FB4.2 R90.2 TP8.1
GND: D29.1(C) D30.2(2_IO) D31.2(2_IO) D32.2(2_IO) D33.2(GND) D34.2(GND) J8.1(MNT_1) J8.2(MNT_2) J8.3(MNT_3) J8.4(MNT_4) J8.A1-B12(GND)
CC1_DEBUG: D31.1(1_IO) J8.A5(CC1) ; port CC DEBUG.CC1
CC2_DEBUG: D32.1(1_IO) J8.B5(CC2) ; port CC DEBUG.CC2
DEBUG_D_N: D34.1(IO) J8.A7(Dn1) J8.B7(Dn2) ; port USB DATA.N
DEBUG_D_P: D33.1(IO) J8.A6(Dp1) J8.B6(Dp2) ; port USB DATA.P
VBUS_DEBUG: D30.1(1_IO) FB4.1 J8.A4-B9(VBUS) J8.B4-A9(VBUS)
NetD29_2: D29.2(A) R90.1

Not connected (* = marked no-connect by the designer): J8 A8(SBU1)* B1-A12(GND) B8(SBU2)*

### Layout directives
differential pair; rule Differential Pairs Routing [Pref Gap = 5mil    Min Gap  = 5mil    Max Gap  = 5milPref Width = 8.655mil    Min Width  = 8.655mil    Max Width  = 8.655mil]: DEBUG_D_N, DEBUG_D_P

### Library data of the parts
D29 = CMP-44529-000045-1: as D3 on sheet 10_Alimentacion_Externa; Mount: Surface Mount; Packaging: Tape and Reel; Lens Transparency: Clear; Height: 0.75mm; Case/Package: 0603; Length: 1.6mm; Case Code (Metric): 1608; Width: 0.8mm; Color: Green; Case Code (Imperial): 0603
D30-D32 = CMP-00370-140306676-1: as D2 on sheet 10_Alimentacion_Externa; Thickness: 300µm; ComponentLink3URL: https://www.ti.com/lit/ds/symlink/tpd1e04u04.pdf?ts=1701165483995&ref_url=https%253A%252F%252Fwww.ti.com%252Fproduct%252FTPD1E04U04%252Fpart-details%252FTPD1E04U04DPLR; ComponentLink3Description: Manufacturer's Package Drawing; Lifecycle Status: Production; ComponentLink1URL: http://ti.com; ComponentLink2Description: HelpURL; Width: 300µm; ComponentLink2URL: https://www.ti.com/lit/ds/symlink/esd451.pdf; Height: 320µm; Number of Pins: 2; ComponentLink1Description: Manufacturer's Website; Length: 600µm
D33 D34 = CMP-04989-000001-1: as D17 on sheet 20_Conector_USB; RoHS: TRUE; Temperature: -40°C to +125°C; Package: DPY0002A; Temperature Range Low: -40°C; Temperature Range High: +125°C; Category: Diode; Capacitance: 0.9pF; Ambient Temperature Range Low: -40°C; Device Class L3: unset; Device Class L1: Circuit Protection; Ambient Temperature Range High: +125°C; ComponentLink2URL: http://www.ti.com/lit/ds/symlink/esd321.pdf; Octopart: https://octopart.com/esd321dpyr-texas+instruments-94354200; Manufacturer Part Number: ESD321DPYR; Digikey Description: HDMI2.0 ESD PROTECTION; Lead Free: Yes; ComponentLink2Description: Datasheet; Device Class L2: TVS Diodes; Height: 0.45mm; Automotive: No
FB4 = CMP-0686-00610-3: as FB1 on sheet 10_Alimentacion_Externa; Radiation Hardening: No; Material: Ferrite; Frequency: 100MHz; Width: 1.25mm; DC Current: 2A; Max DC Current: 2A; Number of Lines: 1; Package Quantity: 1; Case Code (Metric): 2012; Current Rating: 2A; Case/Package: 0805; Current: 2A; Military Standard: Not; Core Material: Ferrite; Depth: 1.25mm; Contact Plating: Tin; DC Resistance-Max: 45mR; Max Operating Temperature: 125°C; Length: 2mm; Max Current Rating: 2A; REACH SVHC: No SVHC; Termination: SMD/SMT; Min Operating Temperature: -55°C; Series: BLM21P; Test Frequency: 100MHz; Tolerance: 25%; Number of Pins: 2; RoHS Compliant: Yes; Height: 0.85mm; Packaging: Tape and Reel; Lead Free: Lead Free; Case Code (Imperial): 0805
J8 = CMP-245163-000002-1: as J3 on sheet 20_Conector_USB; Octopart: https://octopart.com/usb4110-gf-a-gct-103941985; Temperature: -40°C to +85°C; RoHS: TRUE; Automotive: No; Contact Material: Gold,Nickel; Device Class L1: Connectors; Device Class L2: USB Connectors; Package: 0; Lead Free: Yes; ComponentLink2URL: https://gct.co/files/drawings/usb4110.pdf; Temperature Range High: +85°C; Temperature Range Low: -40°C; Height: 3.46mm; Manufacturer Part Number: USB4110-GF-A; ComponentLink2Description: Datasheet; Device Class L3: unset; Digikey Description: CONN USB 2.0 TYPE-C R/A SMT; Category: Conn
R90 = CMP-1011-00517-2: as R6 on sheet 10_Alimentacion_Externa
TP8 = CMP-2000-05575-2: as TP1 on sheet 10_Alimentacion_Externa; Device Class L1: Connectors; Manufacturer Part Number: 5004; Digikey Description: PC TEST POINT MINIATURE YELLOW; ComponentLink2URL: https://www.keyelco.com/product-pdf.cfm?p=1313; Lead Free: Yes; ComponentLink2Description: Datasheet; Category: Conn; Height: 4.72mm; Octopart: https://octopart.com/5004-keystone-28591; Mouser Description: TEST POINT PC MINI .040"D YELLOW; Device Class L3: unset; Contact Material: Silver; Package: 5004; Automotive: No; Device Class L2: unset; RoHS: TRUE

## Sheet 50_Gestión_Alimentación.SchDoc
size A4; SheetNumber: 4; SheetTotal: 11
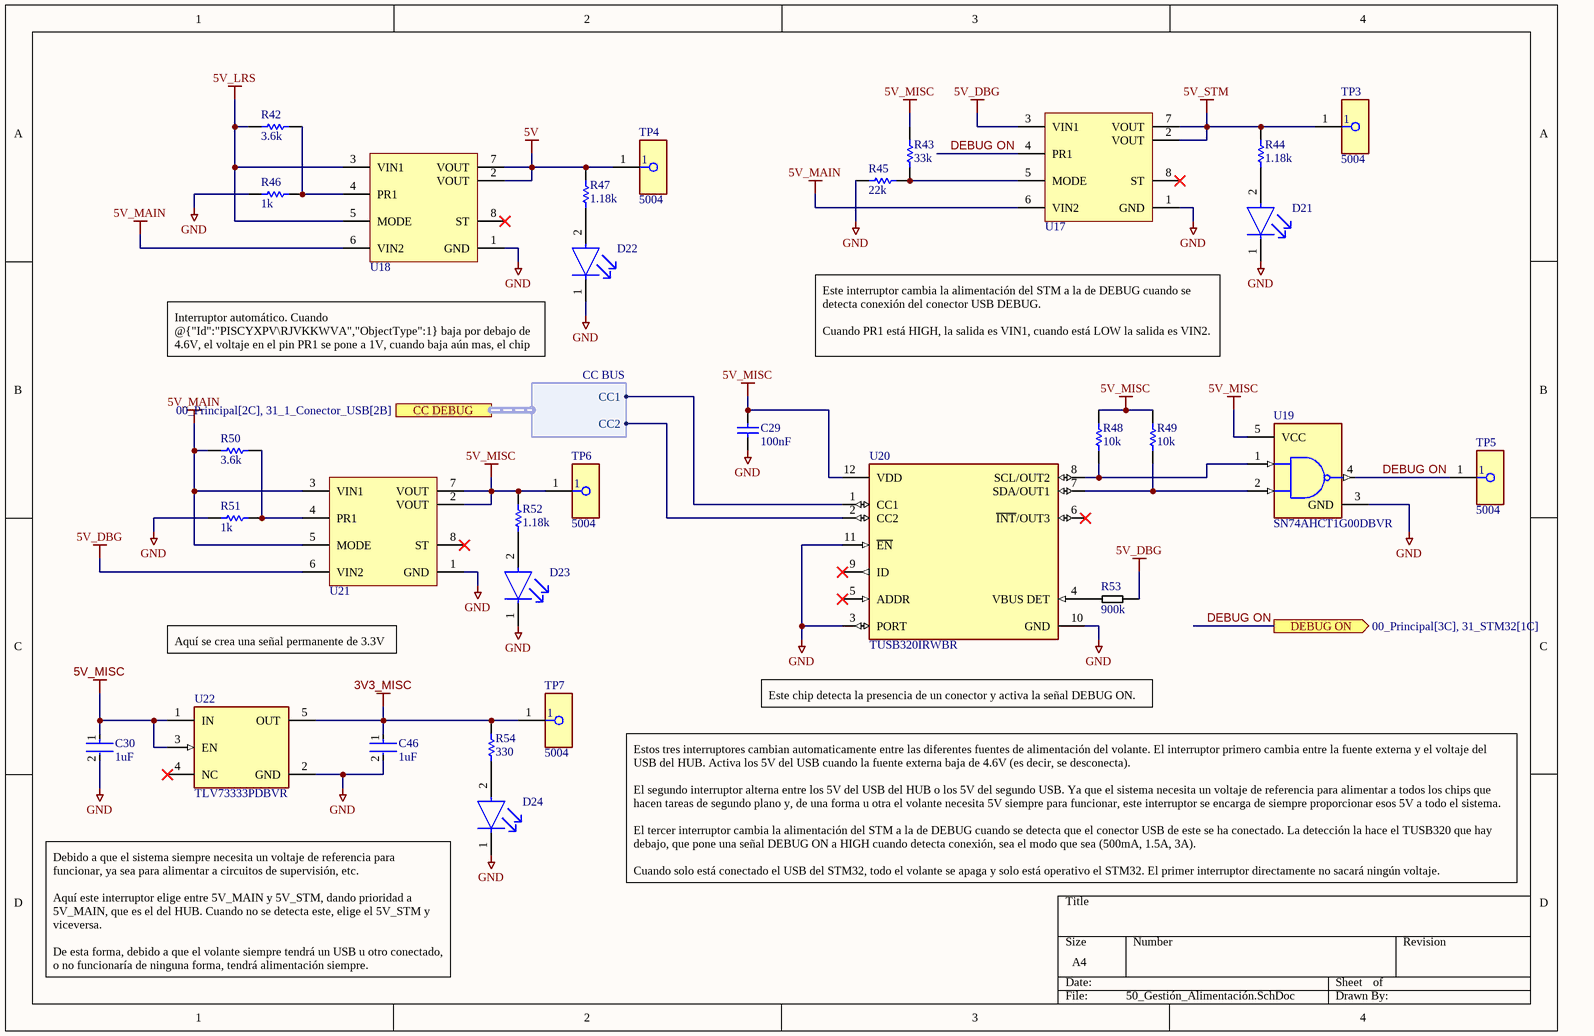
[diagram p5: 50_Gestión_Alimentación.SchDoc]

### Parts
C29  100nF  [CAPC1005X55X25NL05T05]
C30  1uF  [FP-C0402C-BB-IPC_B]
C46  1uF  [FP-C0402C-BB-IPC_B]
D21  APHD1608LZGCK  [FP-APHD1608LZGCK-MFG]  (value not drawn)
D22  APHD1608LZGCK  [FP-APHD1608LZGCK-MFG]  (value not drawn)
D23  APHD1608LZGCK  [FP-APHD1608LZGCK-MFG]  (value not drawn)
D24  APHD1608LZGCK  [FP-APHD1608LZGCK-MFG]  (value not drawn)
R42  3.6k  [RESC1005X40X25ML10T10]
R43  33k  [RESC1005X40X25NL10T10]
R44  1.18k  [RESC1005X40X25NL05T05]
R45  22k  [RESC1005X40X25NL10T10]
R46  1k  [RESC1005X40X25NL05T05]
R47  1.18k  [RESC1005X40X25NL05T05]
R48  10k  [RESC1005X40X25ML05T05]
R49  10k  [RESC1005X40X25ML05T05]
R50  3.6k  [RESC1005X40X25ML10T10]
R51  1k  [RESC1005X40X25NL05T05]
R52  1.18k  [RESC1005X40X25NL05T05]
R53  900k  [RES 1206]
R54  330  [RESC1005X40X25NL10T10]
TP3  5004  [FP-5004-MFG]
TP4  5004  [FP-5004-MFG]
TP5  5004  [FP-5004-MFG]
TP6  5004  [FP-5004-MFG]
TP7  5004  [FP-5004-MFG]
U17  TPS2117DRLR  [TPS2117DRLR]  (value not drawn)
U18  TPS2117DRLR  [TPS2117DRLR]  (value not drawn)
U19  SN74AHCT1G00DBVR  [FP-DBV0005A-IPC_A]
U20  TUSB320IRWBR  [FP-RWB0012A-MFG]
U21  TPS2117DRLR  [TPS2117DRLR]  (value not drawn)
U22  TLV73333PDBVR  [FP-DBV0005A-MFG]

### Ports
CC DEBUG (harness CC BUS, see 00_Principal[2C], 31_1_Conector_USB[2B]), DEBUG ON (out, see 00_Principal[3C], 31_STM32[1C])

### Harnesses
CC BUS: CC1, CC2

### Nets
3V3_MISC: C46.1 R54.2 TP7.1 U22.5(OUT)
5V: R47.2 TP4.1 U18.2(VOUT) U18.7(VOUT)
5V_DBG: R53.1 U17.3(VIN1) U21.6(VIN2)
5V_LRS: R42.1 U18.3(VIN1) U18.5(MODE)
5V_MAIN: R50.1 U17.6(VIN2) U18.6(VIN2) U21.3(VIN1) U21.5(MODE)
5V_MISC: C29.2 C30.1 R43.2 R48.2 R49.2 R52.2 TP6.1 U19.5(VCC) U20.12(VDD) U21.2(VOUT) U21.7(VOUT) U22.1(IN) U22.3(EN)
5V_STM: R44.2 TP3.1 U17.2(VOUT) U17.7(VOUT)
GND: C29.1 C30.2 C46.2 D21.1(C) D22.1(C) D23.1(C) D24.1(C) R45.1 R46.1 R51.1 U17.1(GND) U18.1(GND) U19.3(GND) U20.3(PORT) U20.10(GND) U20.11(~{EN}) U21.1(GND) U22.2(GND)
CC1_DEBUG: U20.1(CC1) ; port CC DEBUG.CC1
CC2_DEBUG: U20.2(CC2) ; port CC DEBUG.CC2
DEBUG ON: TP5.1 U17.4(PR1) U19.4(Y) ; port DEBUG ON
NetD21_2: D21.2(A) R44.1
NetD22_2: D22.2(A) R47.1
NetD23_2: D23.2(A) R52.1
NetD24_2: D24.2(A) R54.1
NetR42_2: R42.2 R46.2 U18.4(PR1)
NetR43_1: R43.1 R45.2 U17.5(MODE)
NetR48_1: R48.1 U19.1(A) U20.8(SCL/OUT2)
NetR49_1: R49.1 U19.2(B) U20.7(SDA/OUT1)
NetR50_2: R50.2 R51.2 U21.4(PR1)
NetR53_2: R53.2 U20.4(VBUS_DET)

Not connected (* = marked no-connect by the designer): U17 8(ST)*; U18 8(ST)*; U20 5(ADDR)* 6(~{INT}/OUT3)* 9(ID)*; U21 8(ST)*; U22 4(NC)*

### Notes on the sheet
- Interruptor automático. Cuando @{"Id":"PISCYXPV\RJVKKWVA","ObjectType":1} baja por debajo de 4.6V, el voltaje en el pin PR1 se pone a 1V, cuando baja aún mas, el chip cambia la salida a VIN2 y no usa 5V_LRS para ello.
- Este interruptor cambia la alimentación del STM a la de DEBUG cuando se detecta conexión del conector USB DEBUG.
  Cuando PR1 está HIGH, la salida es VIN1, cuando está LOW la salida es VIN2.
- Aquí se crea una señal permanente de 3.3V
- Este chip detecta la presencia de un conector y activa la señal DEBUG ON.
- Estos tres interruptores cambian automaticamente entre las diferentes fuentes de alimentación del volante. El interruptor primero cambia entre la fuente externa y el voltaje del USB del HUB. Activa los 5V del USB cuando la fuente externa baja de 4.6V (es decir, se desconecta).
  El segundo interruptor alterna entre los 5V del USB del HUB o los 5V del segundo USB. Ya que el sistema necesita un voltaje de referencia para alimentar a todos los chips que hacen tareas de segundo plano y, de una forma u otra el volante necesita 5V siempre para funcionar, este interruptor se encarga de siempre proporcionar esos 5V a todo el sistema.
  El tercer interruptor cambia la alimentación del STM a la de DEBUG cuando se detecta que el conector USB de este se ha conectado. La detección la hace el TUSB320 que hay debajo, que pone una señal DEBUG ON a HIGH cuando detecta conexión, sea el modo que sea (500mA, 1.5A, 3A).
  Cuando solo está conectado el USB del STM32, todo el volante se apaga y solo está operativo el STM32. El primer interruptor directamente no sacará ningún voltaje.
- Debido a que el sistema siempre necesita un voltaje de referencia para funcionar, ya sea para alimentar a circuitos de supervisión, etc.
  Aquí este interruptor elige entre 5V_MAIN y 5V_STM, dando prioridad a 5V_MAIN, que es el del HUB. Cuando no se detecta este, elige el 5V_STM y viceversa.
  De esta forma, debido a que el volante siempre tendrá un USB u otro conectado, o no funcionaría de ninguna forma, tendrá alimentación siempre.

### Library data of the parts
C29 = CMP-2008-02030-1: as C4 on sheet 20_Conector_USB
C30 C46 = CMP-03020-034679-1: as C5 on sheet 10_Alimentacion_Externa; RoHS Compliant: Yes; Voltage Rating (DC): 16V; Voltage Rating: 16V; Max Operating Temperature: 85°C; Packaging: Cut Tape; Width: 0.02inch; Dielectric: X5R; Lead Free: Lead Free; Min Operating Temperature: -55°C; Mount: Surface Mount; Case/Package: 0402; Thickness: 0.022inch; REACH SVHC: No SVHC; Length: 0.039inch; Case Code (Metric): 1005; Case Code (Imperial): 0402; Capacitance: 1uF
D21-D24 = CMP-44529-000045-1: as D3 on sheet 10_Alimentacion_Externa; Mount: Surface Mount; Packaging: Tape and Reel; Lens Transparency: Clear; Height: 0.75mm; Case/Package: 0603; Length: 1.6mm; Case Code (Metric): 1608; Width: 0.8mm; Color: Green; Case Code (Imperial): 0603
R42 R50 = CMP-2002-05802-1: Manufacturer: Panasonic; Part Number: ERA-2AEB362X
R43 = CMP-2002-05855-1: Part Number: ERA-2AED333X; Manufacturer: Panasonic
R44 R47 R52 = CMP-1011-00517-2: as R6 on sheet 10_Alimentacion_Externa
R45 = CMP-2002-05849-1: Manufacturer: Panasonic; Part Number: ERA-2AED223X
R46 R51 = CMP-1011-00510-4: Chip Resistor, 1 KOhm, +/- 1%, 100 mW, -55 to 155 degC, 0402 (1005 Metric), RoHS, Tape and Reel; PartNumber: ERJ-2RKF1001X; Manufacturer: Basic Passives; Voltage Rating: 50 V; Case\/Package: 0402; Resistance: 1 KOhm; Power Rating: 100 mW; DatasheetVersion: 04/2015; Radiation Hardening: No; Pins: 2; Height: 0.35 mm; RoHSCompliant: true; Case Code (Imperial): 0402; ComponentLink2Description: Datasheet; ComponentLink1Description: Manufacturer URL; PackageReference: 0402; Mount: Surface Mount; Package Quantity: 10000; Tolerance: 1%; ComponentLink1URL: http://www.panasonic.com/; PackageDescription: 2-Pin Surface Mount Device, Body 1 x 0.5 mm; Mounting Technology: Surface Mount; Case Code (Metric): 1005; ComponentLink2URL: http://industrial.panasonic.com/cdbs/www-data/pdf/RDA0000/AOA0000C86.pdf; REACH SVHC: Yes; Packaging: Tape and Reel; Max Operating Temperature: 155 degC; Min Operating Temperature: -55 degC; Width: 0.5 mm; Length: 1 mm
R48 R49 = CMP-2002-00601-1: as R4 on sheet 10_Alimentacion_Externa
R53 = RT1206CRE07900KL: 900k Resistor 200V 1206 0.5%; Supplier 1: DigiKey; Supplier Part Number 1: 13-RT1206CRE07900KLCT-ND
R54 = CMP-2002-05883-1: as R9 on sheet 10_Alimentacion_Externa
TP3-TP7 = CMP-2000-05575-2: as TP1 on sheet 10_Alimentacion_Externa; Device Class L1: Connectors; Manufacturer Part Number: 5004; Digikey Description: PC TEST POINT MINIATURE YELLOW; ComponentLink2URL: https://www.keyelco.com/product-pdf.cfm?p=1313; Lead Free: Yes; ComponentLink2Description: Datasheet; Category: Conn; Height: 4.72mm; Octopart: https://octopart.com/5004-keystone-28591; Mouser Description: TEST POINT PC MINI .040"D YELLOW; Device Class L3: unset; Contact Material: Silver; Package: 5004; Automotive: No; Device Class L2: unset; RoHS: TRUE
U17 U18 U21 = TPS2117DRLR: Power Switch ICs - Power Distribution 1.6-V to 5.5-V 20-m ? 4-A low IQ power; Supplier 1: DigiKey; Supplier Part Number 1: 296-TPS2117DRLRCT-ND
U19 = CMP-0859-00141-4: IC GATE NAND 1CH 2-INP SOT23-5; Output Current: 8mA; Max Supply Voltage: 5.5V; High Level Output Current: -8mA; Number of Circuits: 1; Schmitt Trigger Input: No; Propagation Delay: 7.9ns; Logic Function: NAND GATE; Min Supply Voltage: 4.5V; Number of Input Lines: 2; Turn-On Delay Time: 9ns; Quiescent Current: 1uA; Length: 2.9mm; Number of Pins: 5; Lead Free: Lead Free; Height: 1.15mm; Case/Package: SOT-23; Termination: SMD/SMT; Packaging: Tape and Reel; Number of Bits: 1; Number of Elements: 1; REACH SVHC: No SVHC; Low Level Output Current: 8mA; Number of Output Lines: 1; Weight: 0.000557oz; Mount: Surface Mount; Max Output Current: 8mA; Max Operating Temperature: 125°C; Contact Plating: Tin; Package Quantity: 1; Min Operating Temperature: -40°C; Number of Outputs: 1; Width: 1.6mm; Radiation Hardening: No; Number of Inputs: 2; Number of Gates: 1
U20 = CMP-04877-000006-1: as U4 on sheet 20_Conector_USB; REACH SVHC: No SVHC; Mount: Surface Mount; Min Operating Temperature: -40°C; Case/Package: TQFP; Lead Free: Lead Free; Length: 1.65mm; Contact Plating: Gold; Height: 0.4mm; Max Operating Temperature: 85°C; Number of Pins: 12; Packaging: Tape and Reel; RoHS Compliant: Yes; Width: 1.65mm
U22 = CMP-04917-000053-1: as U6 on sheet 10_Alimentacion_Externa; Digikey Description: IC REG LINEAR 3.3V 300MA SOT23-5; Manufacturer Part Number: TLV73333PDBVR; Temperature Range High: +125°C; Temperature: -40°C to +125°C; Output Current: 300mA; Mouser Description: LDO Voltage Regulators Capacitr-Free 300-mA 5-SOT-23 -40 to 125; Automotive: No; Height: 1.45mm; Device Class L3: Voltage Regulators - Linear; ComponentLink2Description: Datasheet; Device Class L1: Integrated Circuits (ICs); ComponentLink2URL: http://www.ti.com/lit/ds/symlink/tlv733p.pdf; Octopart: https://octopart.com/tlv73333pdbvr-texas+instruments-51080890; Temperature Range Low: -40°C; RoHS: TRUE; Lead Free: Yes; Output Voltage: 3.3V; Package: DBV0005A; Device Class L2: Power Management ICs; Category: IC